# Altium schematic sheet Radio Module.SchDoc
size Letter
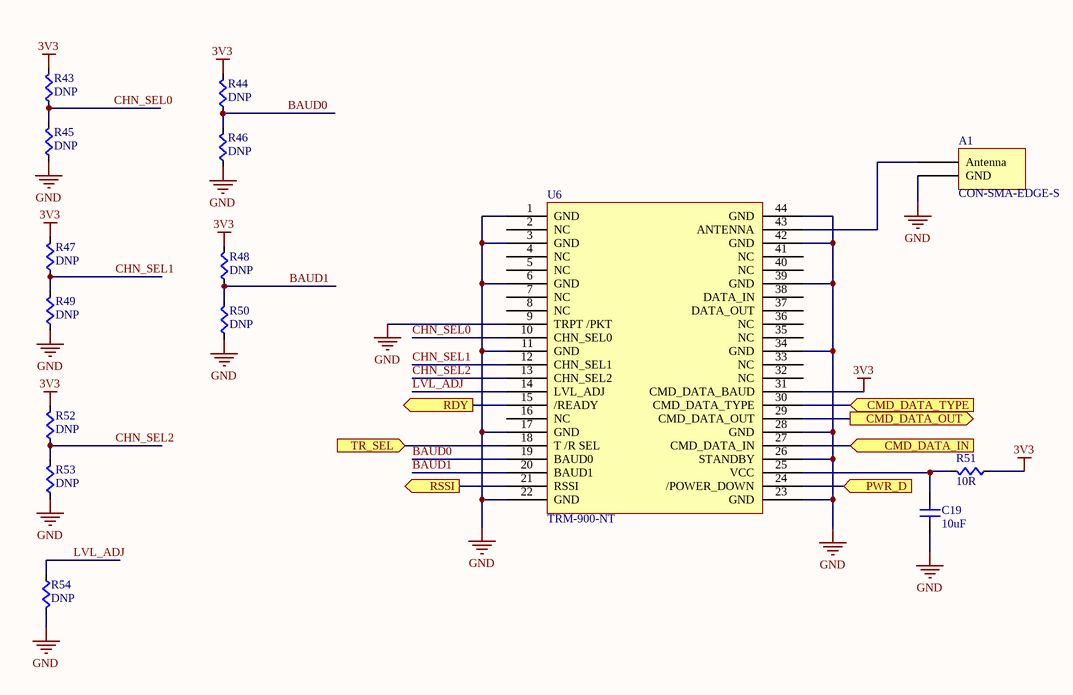
[diagram p0: Radio Module.SchDoc]

## Parts
A1  CON-SMA-EDGE-S  [CON-SMA-EDGE-S]
C19  value 10uF  [CAPC0603]  (hidden comment: Cap)
R43  value DNP  [RES0603]  (hidden comment: Res)
R44  value DNP  [RES0603]  (hidden comment: Res)
R45  value DNP  [RES0603]  (hidden comment: Res)
R46  value DNP  [RES0603]  (hidden comment: Res)
R47  value DNP  [RES0603]  (hidden comment: Res)
R48  value DNP  [RES0603]  (hidden comment: Res)
R49  value DNP  [RES0603]  (hidden comment: Res)
R50  value DNP  [RES0603]  (hidden comment: Res)
R51  value 10R  [RES0603]  (hidden comment: Res)
R52  value DNP  [RES0603]  (hidden comment: Res)
R53  value DNP  [RES0603]  (hidden comment: Res)
R54  value DNP  [RES0603]  (hidden comment: Res)
U6  TRM-900-NT  [TRM-900-NT]

## Ports
CMD_DATA_IN (in), CMD_DATA_OUT (out), CMD_DATA_TYPE (in), PWR_D (in), RDY (out), RSSI (out), TR_SEL (in)

## Nets
3V3: R43.1(A) R44.1(A) R47.1(A) R48.1(A) R51.2(B) R52.1(A) U6.31(CMD_DATA_BAUD)
GND: A1.1(GND) C19.2(B) R45.2(B) R46.2(B) R49.2(B) R50.2(B) R53.2(B) R54.1(A) U6.1(GND) U6.3(GND) U6.6(GND) U6.9(TRPT_/PKT) U6.11(GND) U6.17(GND) U6.22(GND) U6.23(GND) U6.26(STANDBY) U6.28(GND) U6.34(GND) U6.39(GND) U6.42(GND) U6.44(GND)
BAUD0: R44.2(B) R46.1(A) U6.19(BAUD0)
BAUD1: R48.2(B) R50.1(A) U6.20(BAUD1)
CHN_SEL0: R43.2(B) R45.1(A) U6.10(CHN_SEL0)
CHN_SEL1: R47.2(B) R49.1(A) U6.12(CHN_SEL1)
CHN_SEL2: R52.2(B) R53.1(A) U6.13(CHN_SEL2)
CMD_DATA_IN: U6.27(CMD_DATA_IN) ; port CMD_DATA_IN
CMD_DATA_OUT: U6.29(CMD_DATA_OUT) ; port CMD_DATA_OUT
CMD_DATA_TYPE: U6.30(CMD_DATA_TYPE) ; port CMD_DATA_TYPE
LVL_ADJ: R54.2(B) U6.14(LVL_ADJ)
PWR_D: U6.24(/POWER_DOWN) ; port PWR_D
RDY: U6.15(/READY) ; port RDY
RSSI: U6.21(RSSI) ; port RSSI
TR_SEL: U6.18(T_/R_SEL) ; port TR_SEL
NetA1_0: A1.0(Antenna) U6.43(ANTENNA)
NetC19_1: C19.1(A) R51.1(A) U6.25(VCC)

Not connected (* = marked no-connect by the designer): U6 2(NC) 4(NC) 5(NC) 7(NC) 8(NC) 16(NC) 32(NC) 33(NC) 35(NC) 36(NC) 37(DATA_OUT) 38(DATA_IN) 40(NC) 41(NC)

## Library data of the parts
A1 = CON-SMA-EDGE-S: CONN SMA JACK STR EDGE MNT
U6 = TRM-900-NT: RF TXRX MODULE ISM<1GHZ; Manufacturer 1: Linx; Supplier 1: Digi-Key; Supplier Part Number 1: TRM-900-NT-ND; Manufacturer Part Number 1: TRM-900-NT
C19 = Cap: Supplier 1: Digi-Key; Supplier Part Number 1: 1276-1192-1-ND
R43-R54 = Res: Supplier 1: Digi-Key
  R43-R50 R52-R54: Supplier Part Number 1: RMCF0603JT10K0CT-ND
  R51: Supplier Part Number 1: RMCF0603FT10R0CT-ND